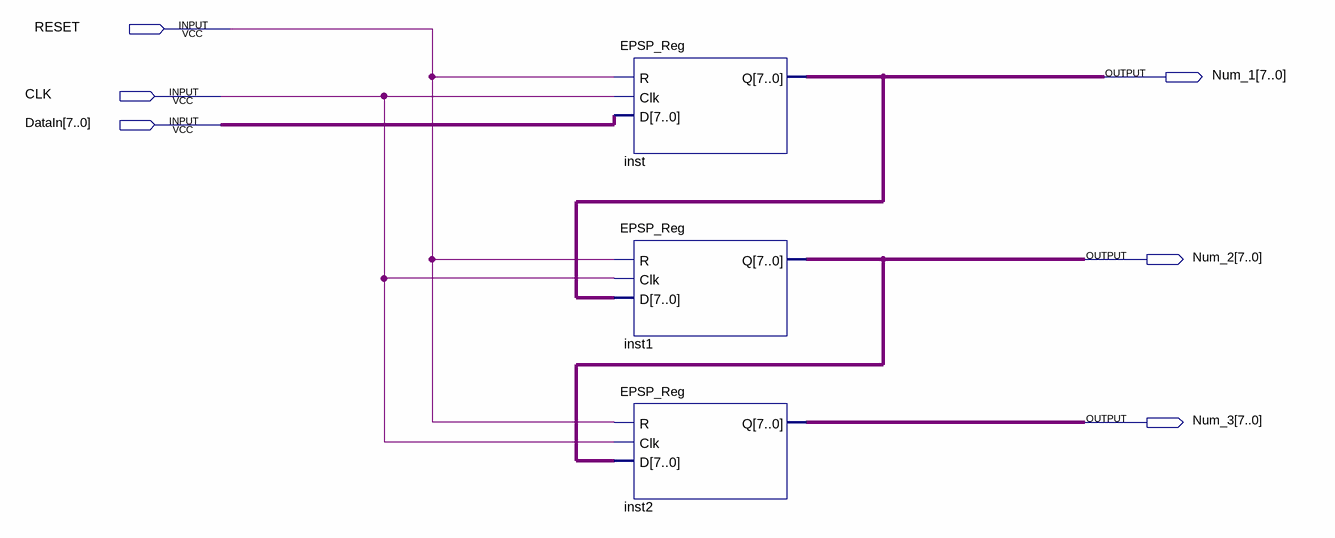
[diagram p0: schematic sheet]
// Quartus schematic Bloc_1_registres.bdf as structural Verilog: 3 symbols, 6 pins
module Bloc_1_registres (
  input  RESET,
  input  CLK,
  input  [7:0] DataIn,
  output [7:0] Num_1,
  output [7:0] Num_2,
  output [7:0] Num_3
);

  EPSP_Reg inst (.R(RESET), .Clk(CLK), .D(DataIn), .Q(Num_1));
  EPSP_Reg inst1 (.R(RESET), .Clk(CLK), .D(Num_1), .Q(Num_2));
  EPSP_Reg inst2 (.R(RESET), .Clk(CLK), .D(Num_2), .Q(Num_3));
endmodule
